# Altium schematic sheet 02-PowerIn.SchDoc
size A4
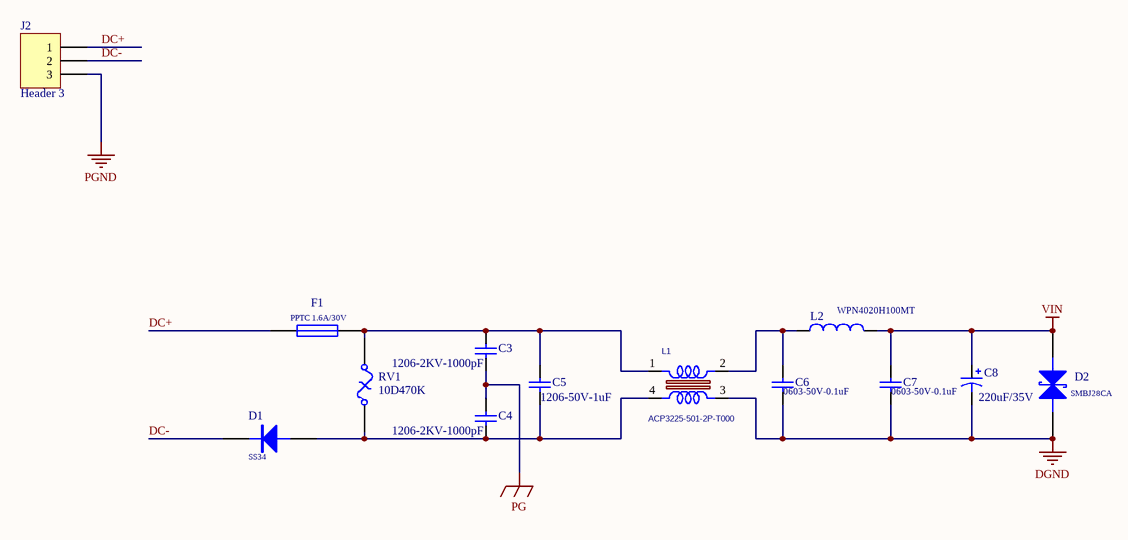
[diagram p0: 02-PowerIn.SchDoc]

## Parts
C3  1206-2KV-1000pF  [1206C]
C4  1206-2KV-1000pF  [1206C]
C5  1206-50V-1uF  [1206C]
C6  0603-50V-0.1uF  [0603C]
C7  0603-50V-0.1uF  [0603C]
C8  value 220uF/35V  [CAP-D8.0XH10.5]  (hidden comment: CK1V221MCRF10)
D1  SS34  [SMA]
D2  SMBJ28CA  [SMB-TVS]
F1  PPTC 1.6A/30V  [F-1.60A-30V]
J2  Header 3  [KF2EDGR-5.08-3P]
L1  ACP3225-501-2P-T000  [1210_4P]
L2  WPN4020H100MT  [4012]
RV1  10D470K  [PS-RES-12.5*5.4]

## Nets
DGND: C6.2 C7.2 C8.2 D2.1(A) L1.3
PG: C3.1 C4.2
PGND: J2.3
VIN: C7.1 C8.1 D2.2(K) L2.2
DC+: F1.2 J2.1
DC-: D1.2 J2.2
NetC3_2: C3.2 C5.2 F1.1 L1.1 RV1.2
NetC4_1: C4.1 C5.1 D1.1 L1.4 RV1.1
NetC6_1: C6.1 L1.2 L2.1

## Library data of the parts
C3-C5 = Cap: Capacitor; Published: 8-Jun-2000; LatestRevisionDate: 17-Jul-2002; LatestRevisionNote: Re-released for DXP Platform.; Publisher: Altium Limited
C6 C7 = Cap: Capacitor; Value: 10nF; Published: 8-Jun-2000; Revision: July-2002: Re-released for DXP Platform.; Publisher: Altium Limited
C8 = Cap Pol1: Polarized Capacitor (Radial); 厂家: ST(先科); 封装: SMD,8x10.5mm; Published: 8-Jun-2000; LatestRevisionDate: 17-Jul-2002; LatestRevisionNote: Re-released for DXP Platform.; PackageReference: RB7.6-15; Publisher: Altium Limited; PackageDescription: Polarized Capacitor (Radial); 2 Leads; 型号: CK1V221MCRF10
D1 = DIODE
D2 = TVSC
F1 = Fuse 1: Fuse; 型号: RL30-160; 厂家: RUILON(瑞隆源); Published: 8-Jun-2000; LatestRevisionDate: 17-Jul-2002; LatestRevisionNote: Re-released for DXP Platform.; PackageReference: PIN-W2/E2.8; Publisher: Altium Limited; PackageDescription: Thru-Hole; 2 Leads
J2 = Header 3: Header, 3-Pin; LatestRevisionDate: 17-Jul-2002; LatestRevisionNote: Re-released for DXP Platform.; Publisher: Altium Limited
L1 = Common Choke: Inductor, TDK,500ohm@100MHz,±25%,2A ,0.4ohm; Manufacturer: Sunlord; Manufacturer P/N: SDCW2012-2-121TF; Mfg2_PN: EXC-24CE201U; DNP: No; Device: 0504CHOKE; Mfg1_PN: DLP11SN900SL2; Dist1: Mouser; Mfg1: Murata; Dist1_PN: 81-DLP11SN900SL2L; Cost_1K: 0.26; Cost_100: 0.32; Myir P/N: 2050400001; Reserve Value: 120ohm; Mfg2: Panasonic; Cost: 0.56; Part Type: Common Inductor; Datasheet: SDCW2012-2.pdf
L2 = Inductor: 贴片功率电感; Code_IEC: 1005; Published: 8-Jun-2000; LatestRevisionDate: 29-May-2009; LatestRevisionNote: IPC-7351 Footprint Added.; PackageReference: 0402-A; Publisher: Altium Limited; PackageDescription: Chip Inductor; Code_JEITA: 0402
RV1 = Fuse Thermal: Thermal Fuse; Published: 24-Mar-1999; LatestRevisionDate: 17-Jul-2002; LatestRevisionNote: Re-released for DXP Platform.; PackageReference: PIN-W2/E2.8; Publisher: Altium Limited; PackageDescription: Thru-Hole; 2 Leads